# EAGLE design stackduino xbee shield (EAGLE 5.06)
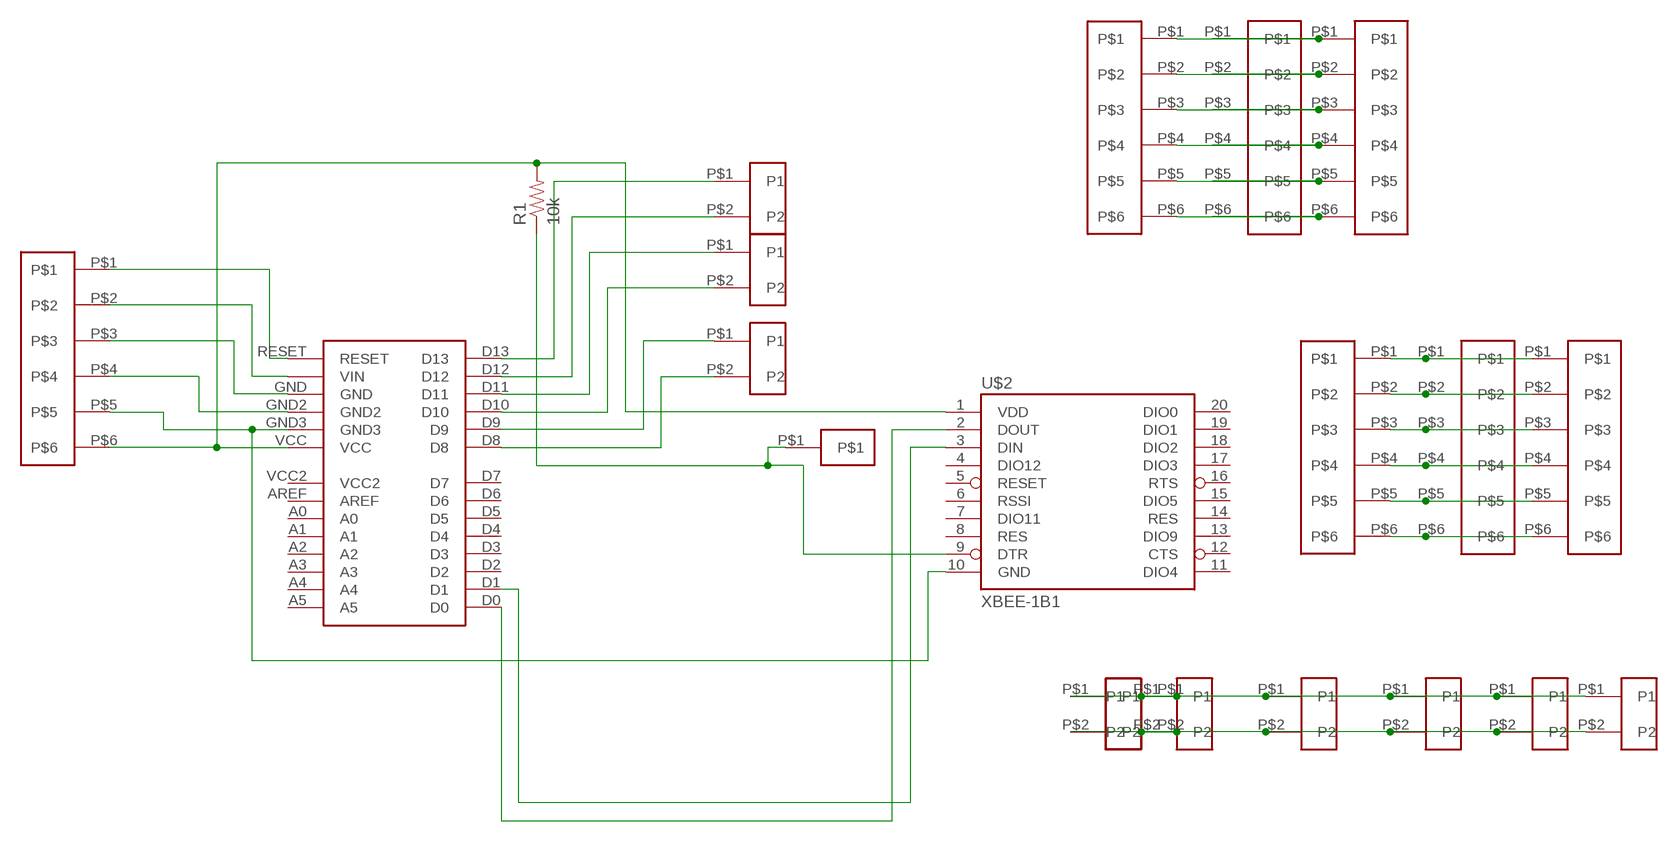
[diagram p0: schematic, sheet 1]

## Parts
R1  10k  RESISTORPTH1  [AXIAL-0.3]
U$1  STACKDUINO_HEADERS  [STACKDUINO_HEADERS]
U$2  XBEE-1B1  [XBEE-1]
U$3  6PIN_GROUP  [6PIN_GROUP]
U$4  2PIN_GROUP  [2PIN_GROUP]
U$5  2PIN_GROUP  [2PIN_GROUP]
U$6  2PIN_GROUP  [2PIN_GROUP]
U$7  1PIN  [1PIN]
U$8  6PIN_GROUP  [6PIN_GROUP]
U$9  6PIN_GROUP  [6PIN_GROUP]
U$10  6PIN_GROUP  [6PIN_GROUP]
U$11  6PIN_GROUP  [6PIN_GROUP]
U$12  6PIN_GROUP  [6PIN_GROUP]
U$13  6PIN_GROUP  [6PIN_GROUP]
U$14  2PIN_GROUP  [2PIN_GROUP]
U$15  2PIN_GROUP  [2PIN_GROUP]
U$16  2PIN_GROUP  [2PIN_GROUP]
U$17  2PIN_GROUP  [2PIN_GROUP]
U$18  2PIN_GROUP  [2PIN_GROUP]
U$19  2PIN_GROUP  [2PIN_GROUP]
U$20  2PIN_GROUP  [2PIN_GROUP]

## Nets
N$1: R1.P$1 U$2.9(DTR) U$7.P$1
N$2: U$8.P$1 U$9.P$1 U$10.P$1
N$3: R1.P$2 U$1.VCC U$2.1(VDD) U$3.P$6
N$4: U$1.GND3 U$2.10(GND) U$3.P$5
N$5: U$8.P$2 U$9.P$2 U$10.P$2
N$6: U$1.D9 U$6.P$1(P1)
N$7: U$1.D8 U$6.P$2(P2)
N$8: U$1.GND U$3.P$3
N$9: U$1.GND2 U$3.P$4
N$10: U$1.VIN U$3.P$2
N$11: U$1.RESET U$3.P$1
N$12: U$1.D0 U$2.2(DOUT)
N$13: U$1.D10 U$5.P$2(P2)
N$14: U$1.D11 U$5.P$1(P1)
N$15: U$1.D12 U$4.P$2(P2)
N$16: U$1.D13 U$4.P$1(P1)
N$17: U$1.D1 U$2.3(DIN)
N$18: U$8.P$3 U$9.P$3 U$10.P$3
N$19: U$8.P$4 U$9.P$4 U$10.P$4
N$20: U$8.P$5 U$9.P$5 U$10.P$5
N$21: U$8.P$6 U$9.P$6 U$10.P$6
N$22: U$11.P$1 U$12.P$1 U$13.P$1
N$23: U$11.P$2 U$12.P$2 U$13.P$2
N$24: U$11.P$3 U$12.P$3 U$13.P$3
N$25: U$11.P$4 U$12.P$4 U$13.P$4
N$26: U$11.P$5 U$12.P$5 U$13.P$5
N$27: U$11.P$6 U$12.P$6 U$13.P$6
N$28: U$14.P$1(P1) U$15.P$1(P1) U$16.P$1(P1) U$17.P$1(P1) U$18.P$1(P1) U$19.P$1(P1) U$20.P$1(P1)
N$29: U$14.P$2(P2) U$15.P$2(P2) U$16.P$2(P2) U$17.P$2(P2) U$18.P$2(P2) U$19.P$2(P2) U$20.P$2(P2)
Unconnected: U$1.A0 U$1.A1 U$1.A2 U$1.A3 U$1.A4 U$1.A5 U$1.AREF U$1.D2 U$1.D3 U$1.D4 U$1.D5 U$1.D6 U$1.D7 U$1.VCC2 U$2.4(DIO12) U$2.5(RESET) U$2.6(RSSI) U$2.7(DIO11) U$2.8(RES) U$2.11(DIO4) U$2.12(CTS) U$2.13(DIO9) U$2.14(RES) U$2.15(DIO5) U$2.16(RTS) U$2.17(DIO3) U$2.18(DIO2) U$2.19(DIO1) U$2.20(DIO0)

## Library data of the parts
R1 = SparkFun:RESISTOR: Resistor Basic schematic elements and footprints for 0603, 1206, and PTH 1/10th watt (small) resistors.
U$1 = edebill:STACKDUINO_HEADERS
U$2 = SparkFun:XBEE-1
U$3 U$8-U$13 = edebill:6PIN_GROUP
U$4-U$6 U$14-U$20 = edebill:2PIN_GROUP
U$7 = edebill:1PIN

## Board
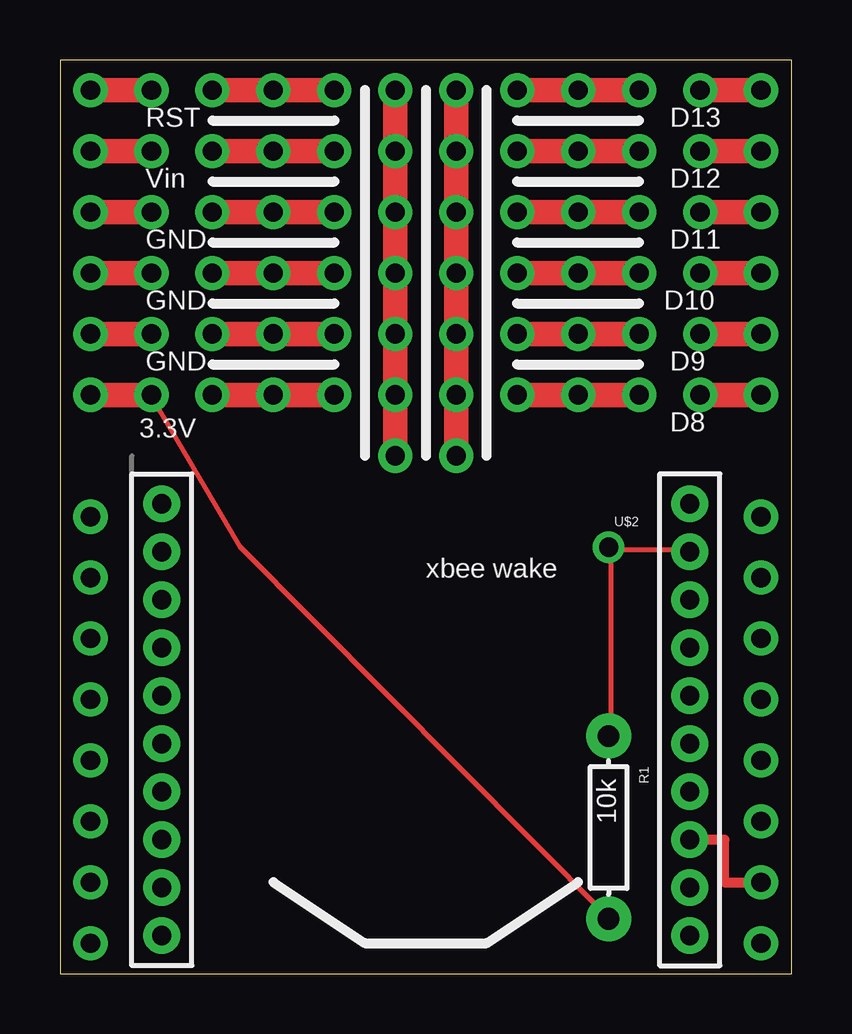
[diagram p1: board, top side]
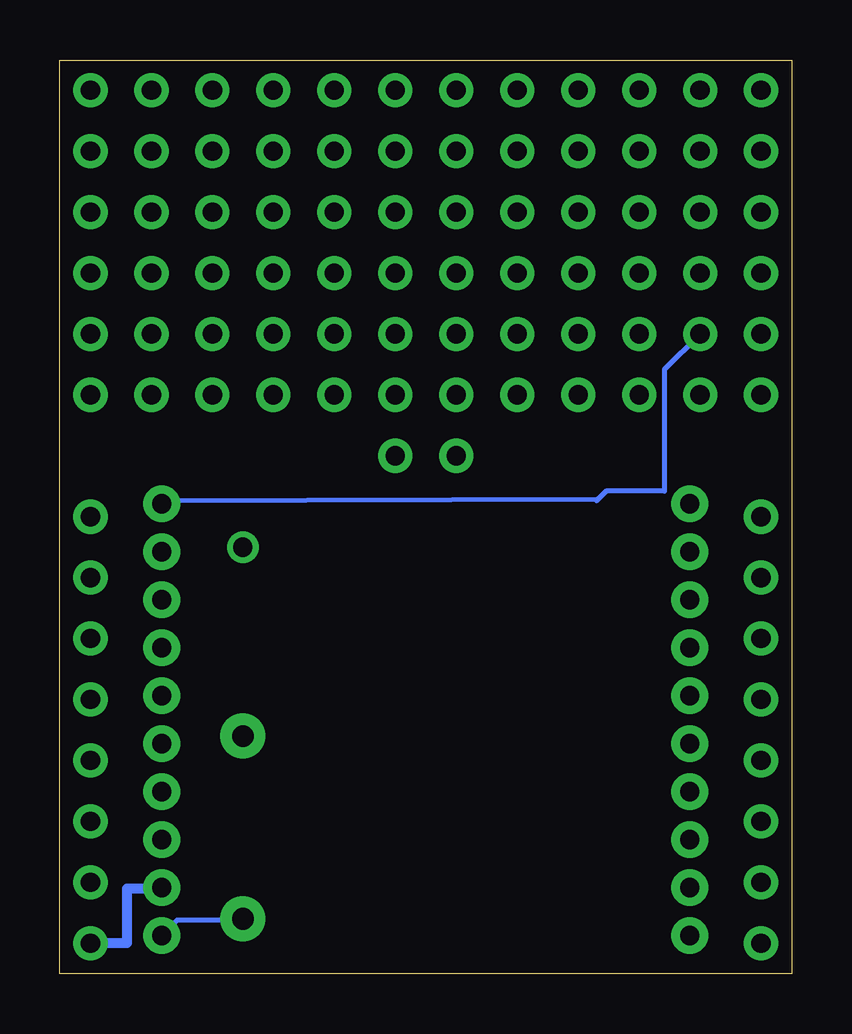
[diagram p2: board, bottom side, seen from below]

Size 30.48 x 38.09 mm. Coordinates in mm from the lower left corner, seen from the top.
Outline: 0,0 30.48,0 30.48,38.09 0,38.09 0,0
Copper layers (1*16): Top 0.035mm / dielectric 1.5mm / Bottom 0.035mm
Design rules "default *": minimum track width 8mil, minimum drill 24mil, track to track 8mil, track to pad 8mil, pad to pad 8mil, via to via 8mil, smd to smd 8mil, copper to edge 40mil, drill to drill 8mil, minimum pad ring 10mil, minimum via ring 8mil, stop-mask expansion 4mil, vias tented up to drill 0mil, thermal gap 10mil

### Footprints (pad centres in the part's own frame; a part is rotated, then mirrored left to right if it is on the bottom)
AXIAL-0.3 = drill 0.9 pad 1.88 round: P$1 -3.81,0; P$2 3.81,0
STACKDUINO_HEADERS = drill 0.8 pad 1.422 round: A0 -13.97,-5.08; A1 -13.97,-7.62; A2 -13.97,-10.16; A3 -13.97,-12.7; A4 -13.97,-15.24; A5 -13.97,-17.78; AREF -13.97,-2.54; D0 13.97,-17.78; D1 13.97,-15.24; D2 13.97,-12.7; D3 13.97,-10.16; D4 13.97,-7.62; D5 13.97,-5.08; D6 13.97,-2.54; D7 13.97,0; D8 13.97,5.08; D9 13.97,7.62; D10 13.97,10.16; D11 13.97,12.7; D12 13.97,15.24; D13 13.97,17.78; GND -13.97,12.7; GND2 -13.97,10.16; GND3 -13.97,7.62; RESET -13.97,17.78; VCC -13.97,5.08; VCC2 -13.97,0; VIN -13.97,15.24
XBEE-1 = drill 0.8 pad 1.524 round: 1 -11,20; 2 -11,18; 3 -11,16; 4 -11,14; 5 -11,12; 6 -11,10; 7 -11,8; 8 -11,6; 9 -11,4; 10 -11,2; 11 11,2; 12 11,4; 13 11,6; 14 11,8; 15 11,10; 16 11,12; 17 11,14; 18 11,16; 19 11,18; 20 11,20
6PIN_GROUP = drill 0.8 pad 1.422 round: P$1 0,6.35; P$2 0,3.81; P$3 0,1.27; P$4 0,-1.27; P$5 0,-3.81; P$6 0,-6.35
2PIN_GROUP = drill 0.8 pad 1.422 round: P$1 0,1.27; P$2 0,-1.27
1PIN = drill 0.8 round: P$1 0,0

### Placement (x,y rotation side)
R1  22.86,6.1 270 top
U$1  15.24,19.05 0 top
U$2  15.24,21.59 180 top
U$3  3.81,30.48 0 top
U$4  26.67,35.56 0 top
U$5  26.67,30.48 0 top
U$6  26.67,25.4 0 top
U$7  22.86,17.78 0 top
U$8  24.13,30.48 0 top
U$9  21.59,30.48 0 top
U$10  19.05,30.48 0 top
U$11  11.43,30.48 0 top
U$12  8.89,30.48 0 top
U$13  6.35,30.48 0 top
U$14  15.24,36.83 90 top
U$15  15.24,34.29 90 top
U$16  15.24,31.75 90 top
U$17  15.24,29.21 90 top
U$18  15.24,26.67 90 top
U$19  15.24,24.13 90 top
U$20  15.24,21.59 90 top

### Tracks (layer width: path | path; a pad name or v marks a point on that pad's centre or on a via)
N$1
  Top 0.203: 22.96,17.68 26.21,17.68 U$2.9 | 22.96,17.68 22.96,9.96 R1.P$1 | 22.96,17.68 U$7.P$1
N$2
  Top 0.203: U$10.P$1 19.1,36.78 21.54,36.78 U$9.P$1 21.74,36.78 23.98,36.78 U$8.P$1
  Top 1.016: U$10.P$1 U$9.P$1 U$8.P$1
N$3
  Top 0.203: U$3.P$6 3.86,23.98 7.52,17.78 22.76,2.44 R1.P$2
  Top 0.406: U$3.P$6 U$1.VCC
  Top 1.016: U$1.VCC U$3.P$6
  Bottom 0.203: U$2.1 26.21,1.63 25.6,2.23 22.96,2.23 R1.P$2
N$4
  Top 0.406: U$3.P$5 U$1.GND3
  Top 1.016: U$3.P$5 U$1.GND3
  Bottom 0.203: 8.13,19.76 | 8.13,19.76 26.21,19.71 U$2.10 | U$3.P$5 5.28,25.2 5.28,20.12 7.72,20.12 8.13,19.71 8.13,19.76
N$5
  Top 0.203: U$10.P$2 19.1,34.34 21.54,34.34 U$9.P$2 21.74,34.34 23.98,34.34 U$8.P$2
  Top 1.016: U$8.P$2 U$10.P$2
N$6
  Top 0.406: U$6.P$1 U$1.D9
  Top 1.016: U$6.P$1 U$1.D9
N$7
  Top 0.406: U$6.P$2 U$1.D8
  Top 1.016: U$6.P$2 U$1.D8
N$8
  Top 0.406: U$1.GND U$3.P$3
  Top 1.016: U$3.P$3 U$1.GND
N$9
  Top 0.406: U$1.GND2 U$3.P$4
  Top 1.016: U$1.GND2 U$3.P$4
N$10
  Top 0.406: U$1.VIN U$3.P$2
  Top 1.016: U$1.VIN U$3.P$2
N$11
  Top 0.406: U$1.RESET U$3.P$1
  Top 1.016: U$3.P$1 U$1.RESET
N$12
  Bottom 0.203: U$2.2 26.21,3.66 26.21,3.56
  Bottom 0.406: 26.16,3.56 26.21,3.56 27.69,3.56 27.69,1.27 U$1.D0
N$13
  Top 0.406: U$5.P$2 U$1.D10
  Top 1.016: U$5.P$2 U$1.D10
N$14
  Top 0.406: U$5.P$1 U$1.D11
  Top 1.016: U$5.P$1 U$1.D11
N$15
  Top 0.406: U$4.P$2 U$1.D12
  Top 1.016: U$4.P$2 U$1.D12
N$16
  Top 0.406: U$4.P$1 U$1.D13
  Top 1.016: U$4.P$1 U$1.D13
N$17
  Top 0.203: U$2.3 26.21,5.69 26.21,5.59
  Top 0.406: 26.16,5.59 26.21,5.59 27.69,5.59 27.69,3.81 U$1.D1
N$18
  Top 0.203: U$10.P$3 19.1,31.9 21.54,31.9 U$9.P$3 21.74,31.9 23.98,31.9 U$8.P$3
  Top 1.016: U$10.P$3 U$8.P$3
N$19
  Top 0.203: U$10.P$4 19.1,29.26 21.54,29.26 U$9.P$4 21.74,29.26 23.98,29.26 U$8.P$4
  Top 1.016: U$10.P$4 U$8.P$4
N$20
  Top 0.203: U$10.P$5 19.1,26.82 21.54,26.82 U$9.P$5 21.74,26.82 23.98,26.82 U$8.P$5
  Top 1.016: U$8.P$5 U$10.P$5
N$21
  Top 0.203: U$10.P$6 19.1,24.18 21.54,24.18 U$9.P$6 21.74,24.18 23.98,24.18 U$8.P$6
  Top 1.016: U$10.P$6 U$8.P$6
N$22
  Top 0.203: U$13.P$1 6.5,36.78 8.74,36.78 U$12.P$1 8.94,36.78 11.38,36.78 U$11.P$1
  Top 1.016: U$11.P$1 U$13.P$1
N$23
  Top 0.203: U$13.P$2 6.5,34.34 8.74,34.34 U$12.P$2 8.94,34.34 11.38,34.34 U$11.P$2
  Top 1.016: U$13.P$2 U$11.P$2
N$24
  Top 0.203: U$13.P$3 6.5,31.9 8.74,31.9 U$12.P$3 8.94,31.9 11.38,31.9 U$11.P$3
  Top 1.016: U$11.P$3 U$13.P$3
N$25
  Top 0.203: U$13.P$4 6.5,29.26 8.74,29.26 U$12.P$4 8.94,29.26 11.38,29.26 U$11.P$4
  Top 1.016: U$13.P$4 U$11.P$4
N$26
  Top 0.203: U$13.P$5 6.5,26.82 8.74,26.82 U$12.P$5 8.94,26.82 11.38,26.82 U$11.P$5
  Top 1.016: U$11.P$5 U$13.P$5
N$27
  Top 0.203: U$13.P$6 6.5,24.18 8.74,24.18 U$12.P$6 8.94,24.18 11.38,24.18 U$11.P$6
  Top 1.016: U$13.P$6 U$11.P$6
N$28
  Top 0.203: U$14.P$1 14.02,36.78 14.02,34.34 U$15.P$1 14.02,34.14 14.02,31.9 U$16.P$1 14.02,31.7 14.02,29.26 U$17.P$1 14.02,29.06 14.02,26.82 U$18.P$1 14.02,26.62 14.02,24.18 U$19.P$1 14.02,23.98 14.02,21.74 U$20.P$1
  Top 1.016: U$14.P$1 U$20.P$1
N$29
  Top 0.203: U$14.P$2 16.46,36.78 16.46,34.34 U$15.P$2 16.46,34.14 16.46,31.9 U$16.P$2 16.46,31.7 16.46,29.26 U$17.P$2 16.46,29.06 16.46,26.82 U$18.P$2 16.46,26.62 16.46,24.18 U$19.P$2 16.46,23.98 16.46,21.74 U$20.P$2
  Top 1.016: U$14.P$2 U$20.P$2

### Text on the board
tPlace: RST | D13 | Vin | D12 | GND | D11 | GND | D10 | GND | D9 | D8 | 3.3V | xbee wake